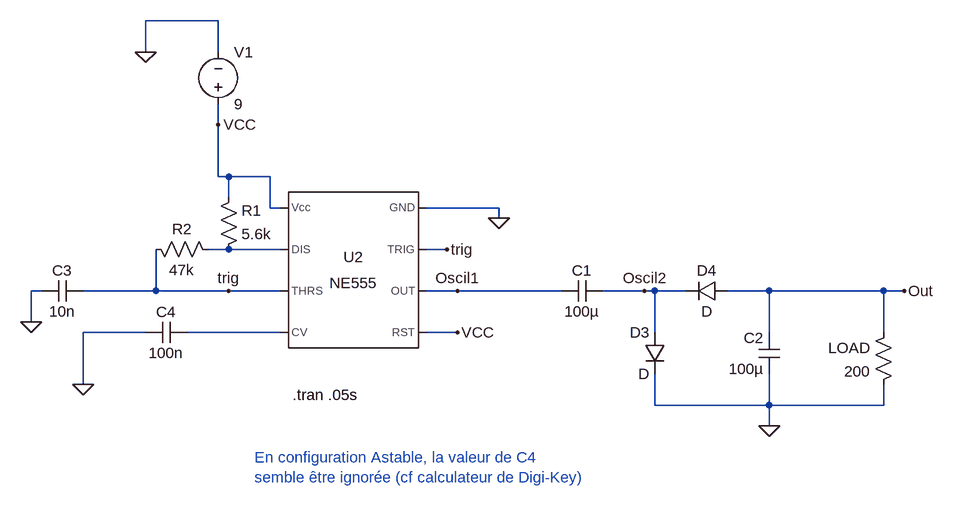
[diagram p0: schematic NE555-NegativeVoltage.asc]
NE555-NegativeVoltage.asc, the LTspice schematic file:
Version 4
SHEET 1 1852 860
WIRE -304 -1184 -416 -1184
WIRE -416 -1136 -416 -1184
WIRE -304 -1136 -304 -1184
WIRE -304 -1024 -304 -1056
WIRE -304 -944 -304 -1024
WIRE -288 -944 -304 -944
WIRE -224 -944 -288 -944
WIRE -288 -912 -288 -944
WIRE -224 -896 -224 -944
WIRE -208 -896 -224 -896
WIRE 128 -896 16 -896
WIRE 128 -880 128 -896
WIRE -288 -832 -320 -832
WIRE -208 -832 -288 -832
WIRE 48 -832 16 -832
WIRE -576 -768 -592 -768
WIRE -400 -768 -400 -832
WIRE -400 -768 -512 -768
WIRE -288 -768 -400 -768
WIRE -208 -768 -288 -768
WIRE 64 -768 16 -768
WIRE 224 -768 64 -768
WIRE 352 -768 288 -768
WIRE 368 -768 352 -768
WIRE 416 -768 368 -768
WIRE 544 -768 480 -768
WIRE 720 -768 544 -768
WIRE 752 -768 720 -768
WIRE -592 -720 -592 -768
WIRE -416 -704 -512 -704
WIRE -208 -704 -352 -704
WIRE 64 -704 16 -704
WIRE 368 -704 368 -768
WIRE 544 -704 544 -768
WIRE 720 -704 720 -768
WIRE -512 -624 -512 -704
WIRE 368 -592 368 -640
WIRE 544 -592 544 -640
WIRE 544 -592 368 -592
WIRE 720 -592 720 -624
WIRE 720 -592 544 -592
WIRE 544 -560 544 -592
FLAG 128 -880 0
FLAG -416 -1136 0
FLAG 48 -832 trig
FLAG -288 -768 trig
FLAG -512 -624 0
FLAG 544 -560 0
FLAG 752 -768 Out
FLAG -304 -1024 VCC
FLAG 64 -704 VCC
FLAG -592 -720 0
FLAG 64 -768 Oscil1
FLAG 352 -768 Oscil2
SYMBOL Misc/NE555 -96 -800 M0
SYMATTR InstName U2
SYMBOL voltage -304 -1040 M180
WINDOW 0 24 96 Left 2
WINDOW 3 24 16 Left 2
WINDOW 123 0 0 Left 0
WINDOW 39 0 0 Left 0
SYMATTR InstName V1
SYMATTR Value 9
SYMBOL res -304 -816 M180
WINDOW 0 36 76 Left 2
WINDOW 3 36 40 Left 2
SYMATTR InstName R1
SYMATTR Value 5.6k
SYMBOL res -416 -848 M90
WINDOW 0 0 56 VBottom 2
WINDOW 3 32 56 VTop 2
SYMATTR InstName R2
SYMATTR Value 47k
SYMBOL cap 224 -784 M90
WINDOW 0 0 32 VBottom 2
WINDOW 3 32 32 VTop 2
SYMATTR InstName C1
SYMATTR Value 100µ
SYMBOL cap 560 -704 M0
SYMATTR InstName C2
SYMATTR Value 100µ
SYMBOL cap -576 -784 M90
WINDOW 0 0 32 VBottom 2
WINDOW 3 32 32 VTop 2
SYMATTR InstName C3
SYMATTR Value 10n
SYMBOL cap -416 -720 M90
WINDOW 0 0 32 VBottom 2
WINDOW 3 32 32 VTop 2
SYMATTR InstName C4
SYMATTR Value 100n
SYMBOL diode 384 -704 M0
SYMATTR InstName D3
SYMBOL diode 480 -752 M270
WINDOW 0 32 32 VTop 2
WINDOW 3 0 32 VBottom 2
SYMATTR InstName D4
SYMBOL res 736 -720 M0
SYMATTR InstName LOAD
SYMATTR Value 200
TEXT -248 -512 Left 2 ;En configuration Astable, la valeur de C4\nsemble être ignorée (cf calculateur de Digi-Key)
TEXT -88 -608 Right 2 !.tran .05s

The netlist it stands for:
* NE555-NegativeVoltage.asc
XU2 0 trig Oscil1 VCC N002 trig N001 VCC NE555  ; pins GND TRIG OUT RST CV THRS DIS Vcc
V1 VCC 0 9
R1 N001 VCC 5.6k
R2 trig N001 47k
C1 Oscil1 Oscil2 100µ
C2 Out 0 100µ
C3 0 trig 10n
C4 0 N002 100n
D3 Oscil2 0 D
D4 Out Oscil2 D
R§LOAD Out 0 200
.model D D
.lib standard.dio
* En configuration Astable, la valeur de C4
* semble être ignorée (cf calculateur de Digi-Key)
.tran .05s
.lib NE555.sub
.backanno
.end